# EasyEDA Pro project TalkingTrain.epro, board PCB3_1
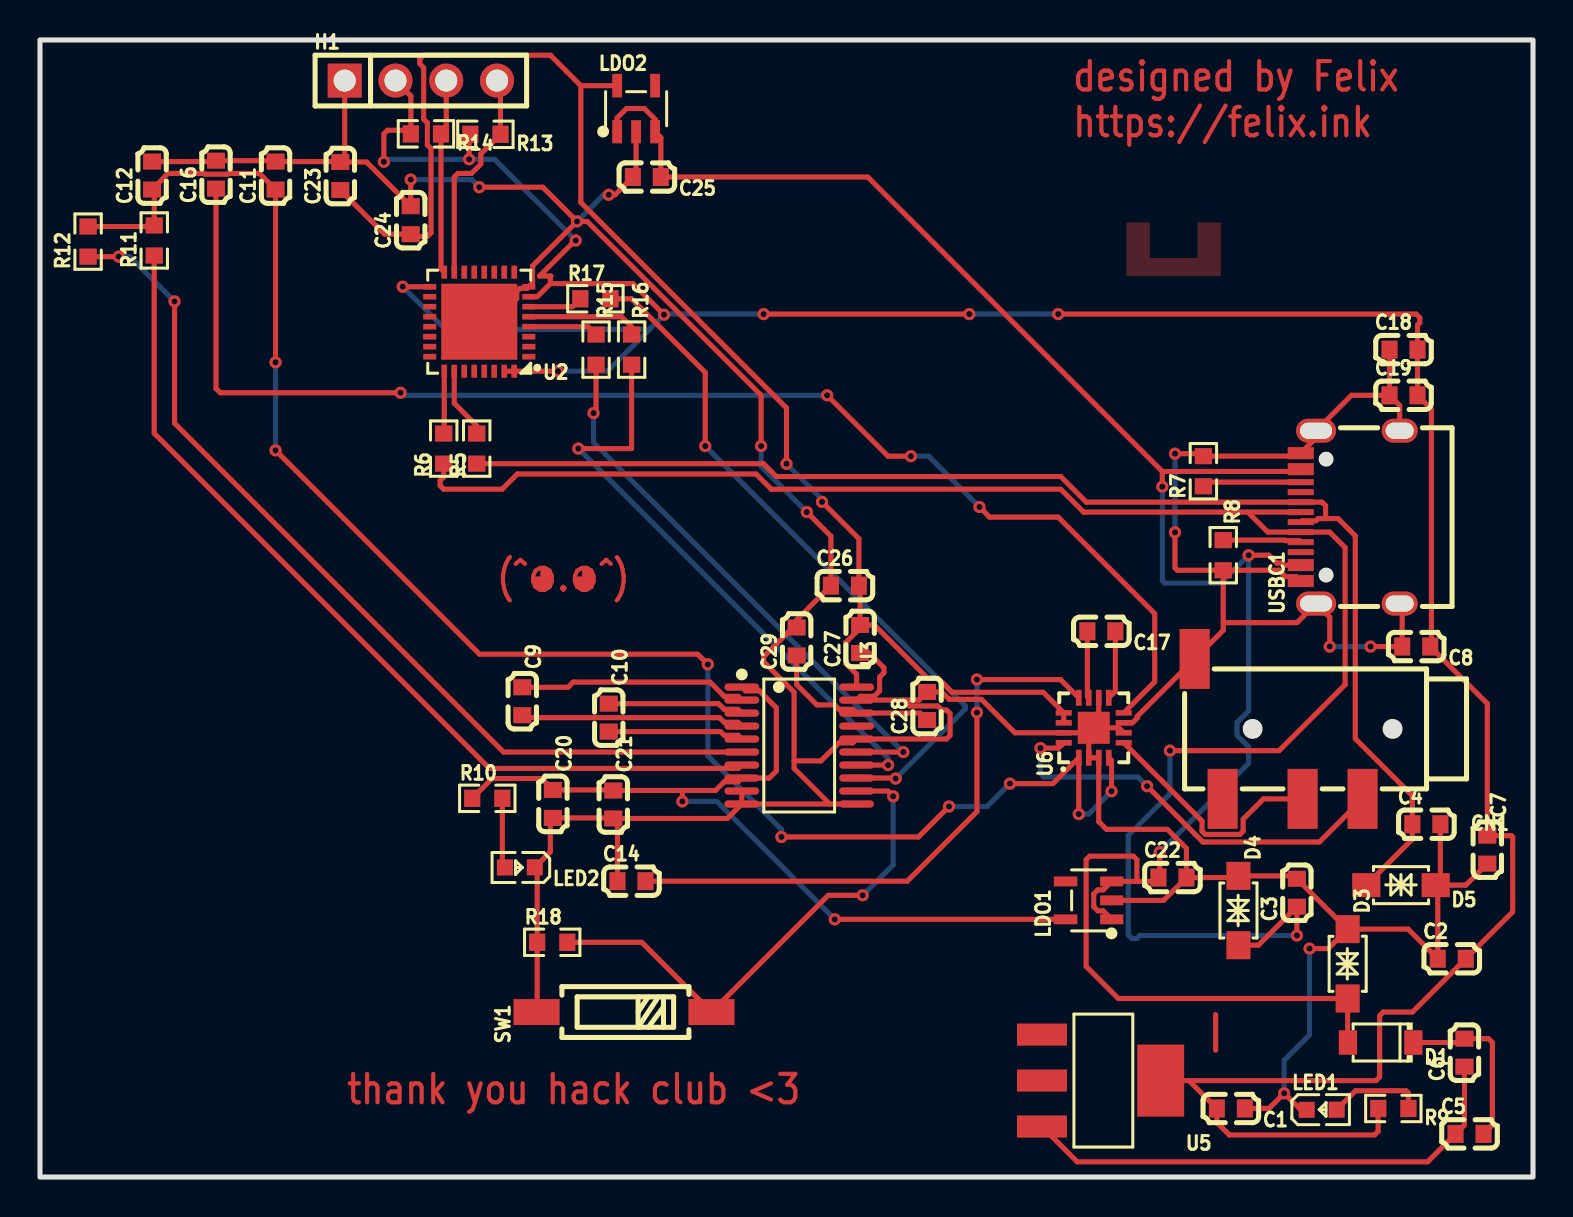
[diagram p1: board, top side]
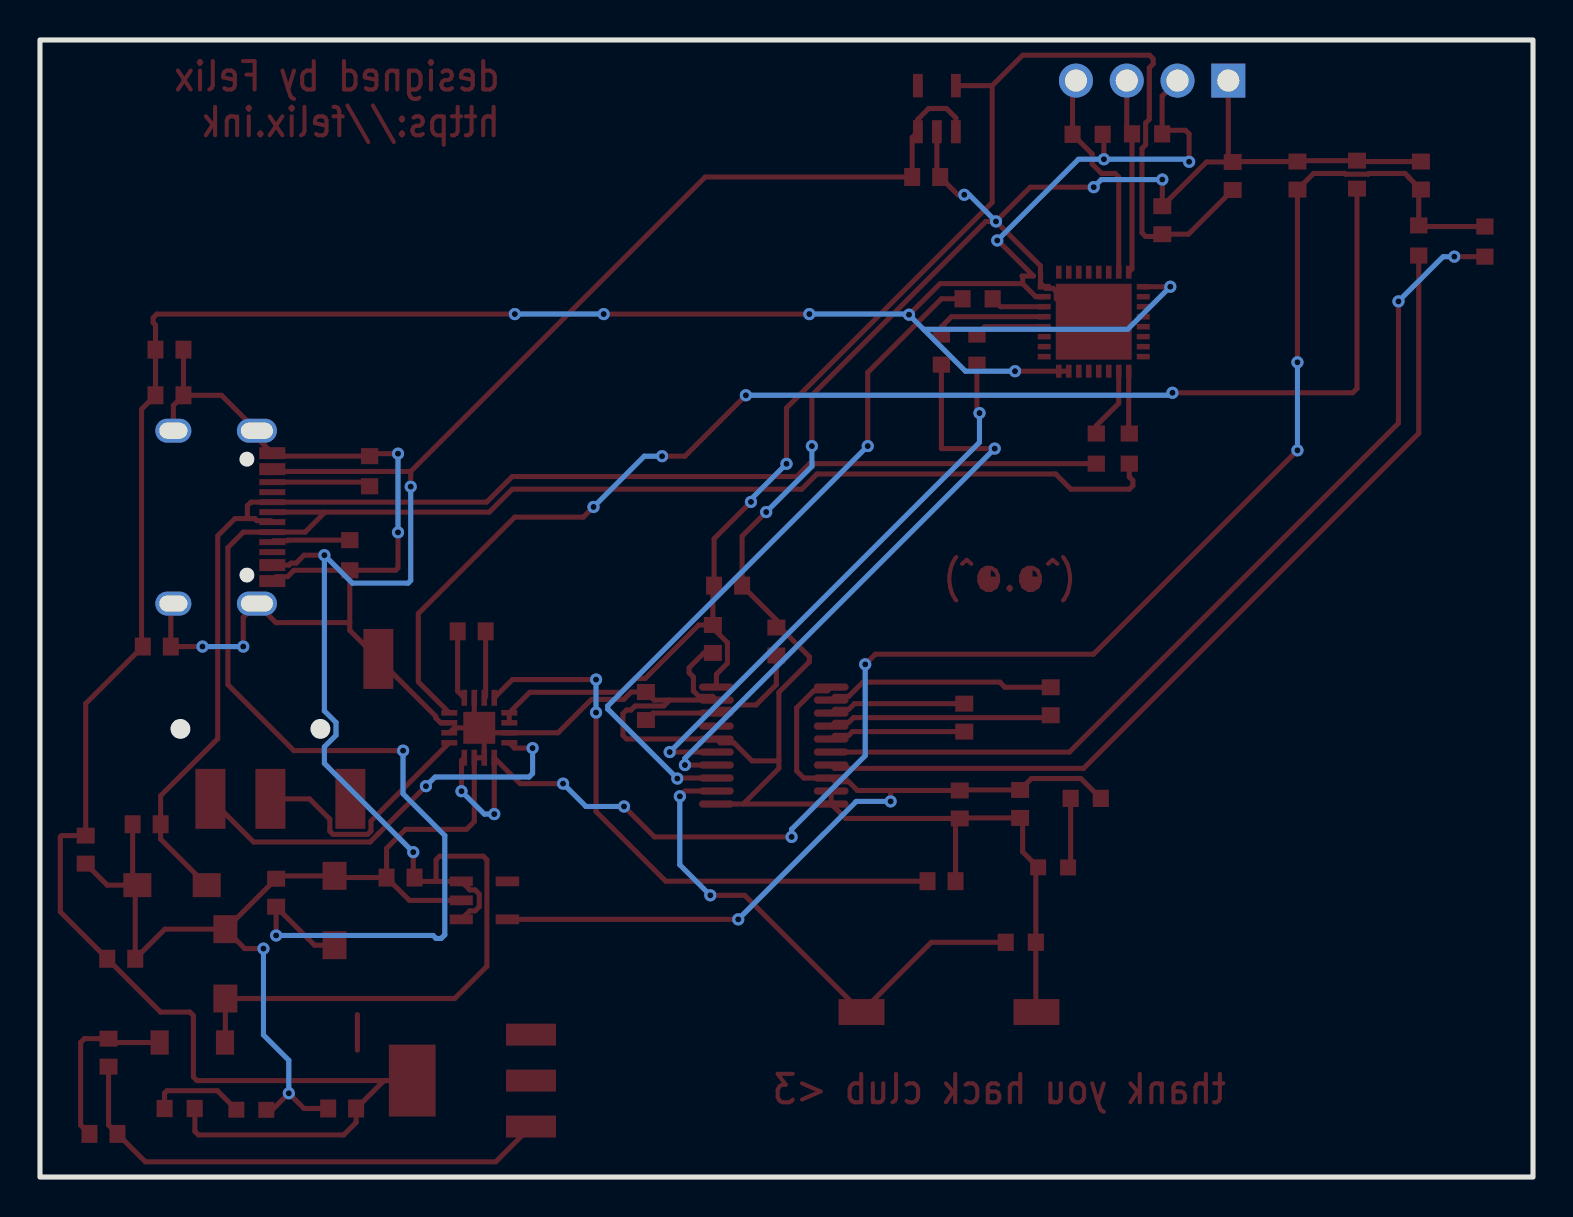
[diagram p2: board, bottom side, seen from below]

Outline 74.68 x 56.9 mm; copper layers: Top Layer, Bottom Layer. Coordinates in mm from the lower left corner of the outline.
Outline path: rectangle 0,56.9 74.68,0
Stack: Top Layer 0.035mm / Dielectric1 1.51mm FR4 er 4.5 / Bottom Layer 0.035mm

## Design rules (mm)
template: JLCPCB Capability(Two Layers Board)
spacing copperThickness1oz (default): track to track 0.102, other pairs 0.152 to 0.3
spacing copperThickness2oz: track to track 0.203, other pairs 0.152 to 0.3
track width copperThickness1oz (default): min 0.127, default 0.254, max 2.54
track width copperThickness2oz: min 0.203, default 0.254, max 2.54
differential pair differentialPair (default): width min 0.127, default 0.254, max 2.54; gap min 0.152, default 0.152
via viaSize (default): diameter min 0.5, default 0.61, max 10; hole min 0.3, default 0.305, max 6.3

## Placement (name value [footprint] x y rotation side)
C1  100nF  [C0603]  59.56 3.43 180 top
C2  1uF  [C0603]  70.61 10.92 0 top
C3  22pF  [C0603]  62.86 14.22 90 top
C4  22pF  [C0603]  69.34 17.65 0 top
C5  10uF  [C0603]  71.5 2.16 0 top
C6  100nF  [C0603]  71.25 6.22 90 top
C7  10uF  [C0603]  72.39 16.38 270 top
C8  100nF  [C0603]  68.83 26.54 180 top
C9  2.2uF  [C0603]  24.12 23.81 270 top
C10  2.2uF  [C0603]  28.45 22.99 270 top
C11  2.2uF  [C0603]  11.78 50.11 90 top
C12  2.2uF  [C0603]  5.61 50.11 90 top
C14  2.2uF  [C0603]  29.58 14.8 0 top
C16  2.2uF  [C0603]  8.8 50.16 90 top
C17  1uF  [C0603]  53.09 27.3 180 top
C18  10nF  [C0603]  68.2 41.4 0 top
C19  1uF  [C0603]  68.2 39.12 0 top
C20  100nF  [C0603]  25.65 18.67 270 top
C21  10uF  [C0603]  28.67 18.64 270 top
C22  100nF  [C0603]  56.64 14.99 0 top
C23  100nF  [C0603]  15.02 50.09 90 top
C24  10uF  [C0603]  18.54 47.88 90 top
C25  100nF  [C0603]  30.35 50.04 180 top
C26  100nF  [C0603]  40.26 29.59 0 top
C27  10uF  [C0603]  41.02 26.92 90 top
C28  10uF  [C0603]  44.37 23.57 90 top
C29  100nF  [C0603]  37.85 26.8 90 top
CN1  PJ-320D  [AUDIO-SMD_PJ-320D-1]  61.95 22.42 180 top
D1  1N5819HW-7-F  [SOD-123_L2.7-W1.6-LS3.7-RD]  67.06 6.73 180 top
D3  SMF6.0CA  [SOD-123FL_L2.7-W1.8-LS3.8-BI]  65.4 10.67 270 top
D4  SMF6.0CA  [SOD-123FL_L2.7-W1.8-LS3.8-BI]  59.94 13.33 270 top
D5  SMF6.0CA  [SOD-123FL_L2.7-W1.8-LS3.8-BI]  68.07 14.6 180 top
H1  2.54-1*4P母  [HDR-TH_4P-P2.54-V-F]  19.05 54.86 0 top
LDO1  ME6211C33M5G-N  [SOT-23-5_L3.0-W1.7-P0.95-LS2.8-BL]  52.45 13.84 90 top
LDO2  ME6211C33M5G-N  [SOT-23-5_L3.0-W1.7-P0.95-LS2.8-BL]  29.82 53.46 0 top
LED1  XL-1608SURC-06  [LED0603-RD_RED]  64.1 3.37 0 top
LED2  XL-1608SURC-06  [LED0603-RD_RED]  24 15.49 180 top
R5  22Ω  [R0603]  21.84 36.45 270 top
R6  22Ω  [R0603]  20.19 36.45 270 top
R7  5kΩ  [R0603]  58.19 35.32 90 top
R8  5kΩ  [R0603]  59.18 31.11 270 top
R9  100Ω  [R0603]  67.69 3.43 180 top
R10  1kΩ  [R0603]  22.37 18.95 0 top
R11  470Ω  [R0603]  5.72 46.86 90 top
R12  470Ω  [R0603]  2.41 46.81 90 top
R13  4.7kΩ  [R0603]  22.28 52.17 180 top
R14  4.7kΩ  [R0603]  19.3 52.2 180 top
R15  220Ω  [R0603]  27.81 41.4 270 top
R16  220Ω  [R0603]  29.59 41.4 270 top
R17  220Ω  [R0603]  27.78 43.94 0 top
R18  220Ω  [R0603]  25.62 11.75 0 top
SW1  DSIC01LSGET  [SW-SMD_DSIC01LSGET]  29.21 8.25 90 top
U2  ESP32-C3FH4  [QFN-32_L5.0-W5.0-P0.50-TL-EP3.7]  21.97 42.8 180 top
U3  PCM5102APWR  [TSSOP-20_L6.5-W4.4-P0.65-LS6.4-BL]  37.97 21.59 270 top
U5  AMS1117-3.3  [SOT-223-3_L6.5-W3.4-P2.30-LS7.0-BR]  53.09 4.83 180 top
U6  TPA6132A2RTER  [WQFN-16_L3.0-W3.0-P0.50-TL-EP1.6]  52.7 22.48 90 top
USBC1  TYPE-C-31-M-12  [USB-C_SMD-TYPE-C-31-M-12_1]  65.53 33.02 90 top

## Footprints (pads in the part's own frame, mm; a bottom-side part is the same pattern mirrored in y, then rotated)
AUDIO-SMD_PJ-320D-1
  rect 1.5x3 smd: 1(4.2,-3.5) 2(-4.2,3.5) 3(-1.2,3.5) 4(2.8,3.5)
C0603
  rect 0.8x0.9 smd: 1(-0.7,0) 2(0.7,0)
HDR-TH_4P-P2.54-V-F
  rect 1.7x1.7 hole 1.1: 1(-3.81,0)
  round 1.7 hole 1.1: 2(-1.27,0) 3(1.27,0) 4(3.81,0)
LED0603-RD_RED
  rect 0.8x0.8 smd: 1(-0.749,-0.004) 2(0.749,0.004)
QFN-32_L5.0-W5.0-P0.50-TL-EP3.7
  rect 0.65x0.28 smd: 1(-2.478,1.75) 2(-2.478,1.25) 3(-2.478,0.75) 4(-2.478,0.25) 5(-2.478,-0.25) 6(-2.478,-0.75) 7(-2.478,-1.25) 8(-2.478,-1.75) 17(2.478,-1.75) 18(2.478,-1.25) 19(2.478,-0.75) 20(2.478,-0.25) 21(2.478,0.25) 22(2.478,0.75) 23(2.478,1.25) 24(2.478,1.75)
  rect 0.28x0.65 smd: 9(-1.75,-2.478) 10(-1.25,-2.478) 11(-0.75,-2.478) 12(-0.25,-2.478) 13(0.25,-2.478) 14(0.75,-2.478) 15(1.25,-2.478) 16(1.75,-2.478) 25(1.75,2.478) 26(1.25,2.478) 27(0.75,2.478) 28(0.25,2.478) 29(-0.25,2.478) 30(-0.75,2.478) 31(-1.25,2.478) 32(-1.75,2.478)
  rect 3.8x3.8 smd: 33(0,0)
R0603
  rect 0.806x0.864 smd: 1(-0.753,0) 2(0.753,0)
SOD-123_L2.7-W1.6-LS3.7-RD
  rect 0.91x1.22 smd: 1(-1.635,0) 2(1.635,0)
SOD-123FL_L2.7-W1.8-LS3.8-BI
  rect 1.4x1.2 smd: 1(-1.735,0) 2(1.735,0)
SOT-23-5_L3.0-W1.7-P0.95-LS2.8-BL
  rect 0.49x1.157 smd: 1(-0.95,-1.153) 2(0,-1.153) 3(0.95,-1.153)
  rect 0.49x1.175 smd: 4(0.95,1.153) 5(-0.95,1.153)
SOT-223-3_L6.5-W3.4-P2.30-LS7.0-BR
  rect 2.5x1.1 smd: 1(2.97,-2.3) 2(2.97,0) 3(2.97,2.3)
  rect 2.34x3.6 smd: 4(-2.97,0)
SW-SMD_DSIC01LSGET
  rect 1.3x2.3 smd: 1(0,4.375) 2(0,-4.375)
TSSOP-20_L6.5-W4.4-P0.65-LS6.4-BL
  oval 0.364x1.742 smd: 1(-2.925,-2.871) 2(-2.275,-2.871) 3(-1.625,-2.871) 4(-0.975,-2.871) 5(-0.325,-2.871) 6(0.325,-2.871) 7(0.975,-2.871) 8(1.625,-2.871) 9(2.275,-2.871) 10(2.925,-2.871) 11(2.925,2.871) 12(2.275,2.871) 13(1.625,2.871) 14(0.975,2.871) 15(0.325,2.871) 16(-0.325,2.871) 17(-0.975,2.871) 18(-1.625,2.871) 19(-2.275,2.871) 20(-2.925,2.871)
USB-C_SMD-TYPE-C-31-M-12_1
  oval 1.2x2 hole 0.8x1.6: 1(4.325,1.706) 4(-4.325,1.706)
  oval 1.2x1.8 hole 0.8x1.4: 2(4.325,-2.474) 3(-4.325,-2.474)
  custom 0.6x1.3 smd: A1B12(-3.2,2.474) A4B9(-2.4,2.474) B1A12(3.2,2.474) B4A9(2.401,2.474)
  rect 0.3x1.3 smd: A5(-1.25,2.474) A6(-0.25,2.474) A7(0.25,2.474) A8(1.25,2.474) B5(1.75,2.474) B6(0.75,2.474) B7(-0.75,2.474) B8(-1.75,2.474)
WQFN-16_L3.0-W3.0-P0.50-TL-EP1.6
  rect 0.8x0.28 smd: 1(-1.5,0.749) 2(-1.5,0.249) 3(-1.5,-0.249) 4(-1.5,-0.75) 9(1.5,-0.75) 10(1.5,-0.249) 11(1.5,0.249) 12(1.5,0.749)
  rect 0.28x0.8 smd: 5(-0.749,-1.5) 6(-0.249,-1.5) 7(0.249,-1.5) 8(0.75,-1.5) 13(0.75,1.5) 14(0.249,1.5) 15(-0.249,1.5) 16(-0.749,1.5)
  rect 1.6x1.6 smd: 17(0,0)

## Nets
GND: C1.1 C2.1 C3.2 C4.2 C7.2 C8.2 C11.2 C12.2 C14.1 C16.2 C18.1 C19.1 C20.2 C21.2 C22.2 C23.2 C24.2 C25.2 C26.1 C27.1 C28.2 C29.2 CN1.1 D3.1 D4.1 D5.1 H1.1 LDO1.2 LDO2.2 LED1.1 LED2.1 R7.2 R8.2 R18.1 SW1.1 U2.8 U2.33 U3.9 U3.10 U3.11 U3.16 U3.19 U6.2 U6.3 U6.6 U6.7 U6.10 U6.15 U6.17 USBC1.1 USBC1.2 USBC1.3 USBC1.4 USBC1.A1B12 USBC1.B1A12
$1N1802: H1.3 R14.1 U2.16
$1N1808: H1.4 R13.1 U2.15
$1N2174: R5.1 U2.26
$1N2178: R6.1 U2.25
$1N2608: R7.1 USBC1.B5
$1N2732: R8.1 USBC1.A5
$1N3437: C22.1 C25.1 D1.2 D3.2 LDO1.1 LDO1.3 LDO2.1 LDO2.3 USBC1.A4B9 USBC1.B4A9
$1N3484: C3.1 D4.2 R6.2 USBC1.A7 USBC1.B7
$1N3488: C4.1 D5.2 R5.2 USBC1.A6 USBC1.B6
$1N4706: C5.1 C6.1 U5.3
$1N4804: C5.2 C6.2 D1.1
$1N5192: LED1.2 R9.1
$1N6728: C9.1 U3.2
$1N6732: C9.2 U3.4
$1N6738: C10.1 U3.3
$1N6815: LED2.2 R10.2
$1N6838: R12.1 U3.6
$1N6938: R11.1 U3.7
$1N7036: C11.1 C12.1 R11.2 R12.2 U6.1 U6.4
$1N7742: CN1.3 U6.5
$1N7752: CN1.2 U6.16
$1N8430: C14.2 U6.12
$1N8534: C16.1 U6.8
$1N8599: C17.1 U6.9
$1N8604: C17.2 U6.11
$1N10130: C1.2 C2.2 C7.1 C8.1 C18.2 C19.2 H1.2 R9.2 R13.2 R14.2 U2.7 U2.17 U2.31 U2.32 U5.4
$1N10789: C20.1 C21.1 LDO1.5 R10.1 U3.1 U3.8
$1N11578: C23.1 C24.1 C26.2 C27.2 LDO2.5 U3.20 U6.13 U6.14
$1N11814: C28.1 C29.1 U3.18
$1N12011: R15.2 U3.15
$1N12041: R16.2 U3.14
$1N12085: R17.2 U3.13
$1N12091: R18.2 SW1.2 U3.12
$1N12135: R17.1 U2.6
$1N12139: R16.1 U2.5
$1N12143: R15.1 U2.4
$1N12295: C10.2 U3.5

Pads without a net: CN1 4; LDO1 4; LDO2 4; U2 1 2 3 9 10 11 12 13 14 18 19 20 21 22 23 24 27 28 29 30; U3 17; U5 1 2; USBC1 A8 B8

## Via types
v1: diameter 0.61, hole 0.305, Top Layer to Bottom Layer, 56 vias

## Routing (per net, layer and track width the routed paths; a pad name or vN(x,y) marks a point on that pad's centre or on a via; arc(x,y) is an arc through that point)
GND: length 247.4
  Top Layer w0.254: 52.46,22.23 U6.2 U6.3 52.95,17.78 53.34,17.4 56.39,17.4 57.34,16.44 C22.2 ; 52.46,22.23 U6.17 ; 52.46,22.23 U6.15 48.76,22.23 47.09,23.9 45.48,23.9 45.11,24.27 C28.2 43.96,23.86 43.18,23.86 ; LDO2.2 29.82,50.2 C25.2 28.76,49.15 v1(28.45,49.15) ; U3.10 34.38,17.94 C21.2 ; U3.10 39.5,18.66 ; U3.10 U3.9 ; D3.1 68.43,12.4 C2.1 69.91,14.5 D5.1 ; D3.1 64.43,11.43 v1(63.5,11.43) ; D3.1 65.39,12.4 C3.2 62.72,15.07 59.94,15.07 59.86,14.99 C22.2 ; H1.1 15.24,51.01 15.02,50.79 ; U6.7 54.64,22.73 54.88,22.97 54.88,23.06 CN1.1 59.18,27.35 59.18,27.74 ; C14.1 28.88,17.73 C21.2 ; C27.1 41.47,26.22 42.21,25.48 42.21,25.23 41.99,25.01 41.99,24.32 41.72,24.05 41.03,24.05 U3.19 43.18,23.86 ; C21.2 28.65,17.97 C20.2 25.53,17.84 25.53,16.27 LED2.1 24.87,15.38 R18.1 24.87,8.29 SW1.1 ; U6.6 53.96,22.48 U6.17 ; 15.02,50.79 15,50.81 C11.2 11.74,50.86 C16.2 8.76,50.81 C12.2 ; 15.02,50.79 16.33,50.79 C24.2 v1(18.54,49.91) ; C7.2 71.31,14.6 D5.1 ; USBC1.2 68.01,38.61 C19.1 ; v1(56.77,32.26) 56.77,30.48 56.89,30.36 R8.2 ; U3.11 39.5,18.66 ; 39.5,18.66 37.72,20.45 37.72,20.82 ; C1.1 61.47,3.43 v1(62.23,4.19) 63.06,3.36 LED1.1 ; D5.1 70.04,14.84 C4.2 ; 37.72,20.82 37.72,24.26 36.2,25.78 36.2,26.03 37.66,27.5 C29.2 37.85,27.88 C26.1 39.56,32.07 v1(38.35,33.27) ; 37.72,20.82 39.06,20.82 39.96,21.73 40.65,21.73 U3.16 40.85,21.92 45.34,21.92 45.52,22.1 45.52,23.19 45.34,23.37 45.11,23.37 44.91,23.57 43.47,23.57 43.18,23.86 ; U6.17 52.95,22.73 U6.10 ; v1(21.97,49.53) 25.15,49.53 v1(26.86,47.82) ; C22.2 56.2,13.84 LDO1.2 ; v1(64.51,26.54) 64.51,28.01 USBC1.4 62.87,27.74 59.18,27.74 ; 59.18,27.74 R8.2 ; C19.1 65.6,39.12 USBC1.1 63.83,36.99 USBC1.B1A12 62.91,36.07 R7.2 58.07,36.19 v1(56.77,36.19) ; C19.1 C18.1 ; U2.33 22.7,42.8 23.84,43.94 23.84,44.3 24.01,44.47 24.37,44.47 U2.8 24.64,44.74 24.64,44.93 24.63,44.94 24.63,45.23 24.64,45.24 24.64,45.59 v1(26.86,47.82) ; R8.2 61.97,30.36 62.29,30.04 62.84,30.04 USBC1.A1B12 ; v1(26.86,47.82) 27.37,47.82 36.07,39.12 v1(36.07,36.58) ; v1(66.55,26.54) C8.2 68.13,28.57 USBC1.3
  Bottom Layer w0.254: v1(56.77,36.19) v1(56.77,32.26) ; v1(21.97,49.53) 21.59,49.91 v1(18.54,49.91) ; v1(63.5,11.43) 63.5,7.11 62.23,5.84 v1(62.23,4.19) ; v1(64.51,26.54) v1(66.55,26.54) ; v1(38.35,33.27) 36.07,35.56 v1(36.07,36.58) ; v1(26.86,47.82) 28.19,49.15 v1(28.45,49.15)
(no net): length 1.8
  Top Layer w0.254: 58.8,6.35 58.8,8.13
$1N1802: length 9.8
  Top Layer w0.254: U2.16 20.06,45.44 R14.1 20.32,52.46 H1.3
$1N1808: length 11
  Top Layer w0.254: U2.15 20.72,50.04 20.9,50.22 21.58,50.22 22.05,50.68 22.05,51.19 R13.1 23.03,54.69 H1.4
$1N2174: length 3.6
  Top Layer w0.254: U2.26 20.72,38.71 21.84,37.59 R5.1
$1N2178: length 3.1
  Top Layer w0.254: U2.25 20.22,37.23 R6.1
$1N2608: length 5
  Top Layer w0.254: USBC1.B5 58.4,34.77 R7.1
$1N2732: length 3.9
  Top Layer w0.254: R8.1 62.27,31.87 62.29,31.84 62.99,31.84 USBC1.A5
$1N3437: length 106.3
  Top Layer w0.254: USBC1.A4B9 62.22,30.62 62.12,30.72 61.87,30.72 61.47,31.11 v1(60.45,31.11) ; 54.8,14.79 54.86,14.86 54.86,15.87 54.68,16.05 52.5,16.05 52.32,15.87 52.32,10.54 53.93,8.93 D3.2 65.4,6.75 D1.2 ; 54.8,14.79 LDO1.3 53.18,14.37 52.91,14.37 52.7,14.16 52.7,13.52 52.91,13.32 53.18,13.32 LDO1.1 ; 54.8,14.79 55.75,14.79 56.01,15.05 v1(56.01,16.26) ; 56.13,35.31 41.4,50.04 C25.1 31.05,52.02 LDO2.3 30.77,52.93 30.23,53.47 29.34,53.47 28.87,53 LDO2.1 ; 56.13,35.31 v1(56.13,34.54) ; 56.13,35.31 62.94,35.31 USBC1.B4A9
  Bottom Layer w0.254: v1(56.01,16.26) 60.45,20.7 60.45,21.52 59.87,22.1 59.87,22.75 60.45,23.33 v1(60.45,31.11) 59.05,29.72 56.26,29.72 56.13,29.84 v1(56.13,34.54)
$1N3484: length 91.8
  Top Layer w0.254: R6.2 20.19,35.03 20.01,34.85 20.01,34.6 20.19,34.42 23.11,34.42 23.88,35.18 35.81,35.18 36.58,34.42 51.05,34.42 52.2,33.27 60.41,33.27 ; v1(56.52,21.34) 61.98,21.34 65.28,24.64 65.28,31.5 64.5,32.27 USBC1.B7 61.41,32.27 60.41,33.27 ; v1(62.86,12.09) C3.1 60.94,11.6 D4.2 ; USBC1.A7 60.41,33.27
  Bottom Layer w0.254: v1(56.52,21.34) 56.52,19.18 54.43,17.09 54.43,12.12 54.61,11.94 54.86,11.94 55.01,12.09 v1(62.86,12.09)
$1N3488: length 66.8
  Top Layer w0.254: USBC1.A6 63.13,32.84 63.82,32.84 63.93,32.95 64.3,32.95 ; 64.3,32.95 64.93,32.95 65.79,32.09 65.79,21.93 68.64,19.08 C4.1 68.64,16.91 D5.2 ; 64.3,32.95 64.3,33.59 64.12,33.77 USBC1.B6 52.34,33.77 51.05,35.05 36.83,35.05 36.19,35.7 R5.2
$1N4706: length 25.5
  Top Layer w0.254: U5.3 51.88,0.76 69.4,0.76 C5.1 71.25,2.6 C6.1
$1N4804: length 8.9
  Top Layer w0.254: D1.1 71.05,6.73 C6.2 72.45,6.92 72.64,6.73 72.64,2.6 C5.2
$1N5192: length 4.8
  Top Layer w0.254: R9.1 68.44,4.2 68.33,4.32 65.8,4.32 LED1.2
$1N6728: length 11.5
  Top Layer w0.254: U3.2 34.91,24.05 34.22,24.05 33.51,24.76 26.67,24.76 26.41,24.51 C9.1
$1N6732: length 11.2
  Top Layer w0.254: U3.4 34.91,22.75 34.22,22.75 33.99,22.99 24.24,22.99 C9.2
$1N6738: length 6.8
  Top Layer w0.254: U3.3 34.91,23.4 34.22,23.4 33.94,23.69 C10.1
$1N6815: length 3.5
  Top Layer w0.254: R10.2 23.13,15.62 LED2.2
$1N6838: length 46.5
  Top Layer w0.254: v1(6.73,43.81) 6.73,37.72 23.18,21.26 U3.6 ; R12.1 v1(3.94,46.05)
  Bottom Layer w0.254: v1(6.73,43.81) 4.49,46.05 v1(3.94,46.05)
$1N6938: length 45.3
  Top Layer w0.254: U3.7 34.93,20.45 22.48,20.45 5.72,37.21 R11.1
$1N7036: length 84.5
  Top Layer w0.254: v1(11.78,40.77) C11.1 10.98,50.22 9.41,50.22 9.37,50.18 8.24,50.18 8.2,50.22 6.4,50.22 6.22,50.04 6.22,50.03 C12.1 5.72,49.3 R11.2 5.66,47.56 R12.2 ; v1(45.47,18.54) 43.94,17.02 v1(37.08,17.02) ; v1(11.78,36.36) 21.98,26.16 32.89,26.16 v1(33.4,25.65) ; v1(53.59,19.3) 53.59,20.84 U6.4 ; v1(51.96,18.16) U6.1 50.66,19.68 v1(48.51,19.68)
  Bottom Layer w0.254: v1(51.96,18.16) 52.45,18.16 v1(53.59,19.3) ; v1(37.08,17.02) 37.08,17.4 33.4,21.08 v1(33.4,25.65) ; v1(45.47,18.54) 47.37,18.54 v1(48.51,19.68) ; v1(11.78,40.77) v1(11.78,36.36)
$1N7742: length 12.2
  Top Layer w0.254: U6.5 58.12,17.81 58.12,17.31 58.29,17.14 60.02,17.14 60.18,17.31 60.18,17.91 61.2,18.92 CN1.3
$1N7752: length 21
  Top Layer w0.254: U6.16 50.94,21.46 v1(50.04,21.46) ; v1(55.37,19.56) 57.77,17.16 57.77,17.16 58.14,16.79 58.14,16.79 58.17,16.76 63.99,16.76 CN1.2
  Bottom Layer w0.254: v1(50.04,21.46) 50.04,20.19 50.22,20.01 54.92,20.01 v1(55.37,19.56)
$1N8430: length 30.1
  Top Layer w0.254: U6.12 51.04,24.89 v1(46.86,24.89) ; 30.28,14.8 43.38,14.8 46.86,18.29 v1(46.86,23.24)
  Bottom Layer w0.254: v1(46.86,24.89) v1(46.86,23.24)
$1N8534: length 67.2
  Top Layer w0.254: U6.8 55.75,24.78 55.75,28.19 50.93,33.02 47.5,33.02 v1(46.99,33.53) ; v1(43.56,36.07) 42.42,36.07 v1(39.37,39.12) ; C16.1 8.8,39.46 9.02,39.24 v1(18.03,39.24)
  Bottom Layer w0.254: v1(43.56,36.07) 44.45,36.07 v1(46.99,33.53) ; v1(39.37,39.12) 18.16,39.12 v1(18.03,39.24)
$1N8599: length 3.5
  Top Layer w0.254: C17.1 53.79,24.31 U6.9
$1N8604: length 3.4
  Top Layer w0.254: U6.11 52.39,24.05 C17.2
$1N10130: length 158.9
  Top Layer w0.254: v1(31.21,43.15) 29.65,44.7 25.53,44.7 ; 25.53,44.7 25.53,45.06 25.55,45.08 24.98,45.08 26.76,46.86 v1(26.8,46.86) ; 25.53,44.7 24.87,44.05 U2.7 ; U2.17 v1(18.14,44.55) ; R13.2 21.46,52.11 v1(21.46,50.93) ; v1(25.91,40.32) U2.32 U2.31 ; H1.2 18.55,54.09 R14.2 18.37,52.38 17.38,52.38 17.2,52.2 v1(17.2,50.8) ; 57.47,4.83 C1.2 58.86,2.73 59.49,2.11 66.75,2.11 66.93,2.29 66.93,3.42 R9.2 ; 57.47,4.83 66.82,4.83 67,5.01 67,8.08 67.18,8.25 68.64,8.25 C2.2 73.66,13.27 73.66,17.02 73.59,17.08 C7.1 72.39,23.69 C8.1 69.6,26.6 69.6,38.42 C19.2 C18.2 68.9,42.63 69.01,42.75 69.01,43 68.83,43.18 v1(50.93,43.18) ; 57.47,4.83 U5.4 ; v1(36.2,43.18) v1(46.48,43.18)
  Bottom Layer w0.254: v1(36.2,43.18) 31.24,43.18 v1(31.21,43.15) 30.48,42.42 ; 30.48,42.42 20.27,42.42 v1(18.14,44.55) ; 30.48,42.42 28.38,40.32 v1(25.91,40.32) ; v1(26.8,46.86) 22.73,50.93 v1(21.46,50.93) 17.33,50.93 v1(17.2,50.8) ; v1(46.48,43.18) v1(50.93,43.18)
$1N10789: length 43.8
  Top Layer w0.254: LDO1.5 v1(39.75,12.89) ; 32.12,19.34 C21.1 28.65,19.37 C20.1 25.08,19.94 22.61,19.94 R10.1 ; 32.12,19.34 32.13,19.33 v1(32.13,18.8) ; 32.12,19.34 33.79,19.34 34.22,19.78 34.91,19.78 U3.8 36.48,19.96 36.83,20.32 36.83,23.48 35.98,24.33 35.29,24.33 U3.1
  Bottom Layer w0.254: v1(32.13,18.8) 33.85,18.8 v1(39.75,12.89)
$1N11578: length 74
  Top Layer w0.254: 41.02,27.62 40.84,27.45 40.84,27.29 40.29,26.74 40.29,25.71 40.84,25.16 U3.20 ; 41.02,27.62 41.02,29.53 C26.2 40.96,31.94 v1(39.12,33.78) ; 41.02,27.62 41.73,27.62 44.41,24.95 44.93,24.95 45.62,24.26 50.18,24.26 U6.13 U6.14 ; 27.05,54.61 25.53,56.13 19.18,56.13 19,55.95 19,55.7 19.19,55.51 19.19,52.93 19.37,52.74 19.37,51.65 19.56,51.47 19.56,47.24 19.38,47.06 18.66,47.06 C24.1 17.23,47.18 C23.1 ; 27.05,54.61 LDO2.5 ; 27.05,54.61 27.05,48.77 37.34,38.48 v1(37.34,35.69)
  Bottom Layer w0.254: v1(39.12,33.78) 39.12,33.91 v1(37.34,35.69)
$1N11814: length 8.7
  Top Layer w0.254: C29.1 37.85,24.64 38.86,23.62 39.75,23.62 39.96,23.4 40.65,23.4 U3.18 44.02,23.21 C28.1
$1N12011: length 28.2
  Top Layer w0.254: v1(27.69,38.23) 27.81,38.35 R15.2 ; U3.15 v1(43.18,21.26)
  Bottom Layer w0.254: v1(43.18,21.26) 27.69,36.76 v1(27.69,38.23)
$1N12041: length 30.7
  Top Layer w0.254: R16.2 29.59,36.45 v1(26.92,36.45) ; U3.14 v1(42.42,20.61)
  Bottom Layer w0.254: v1(42.42,20.61) 42.42,20.95 v1(26.92,36.45)
$1N12085: length 35.4
  Top Layer w0.254: v1(33.27,36.58) 33.27,40.26 29.59,43.94 R17.2 ; v1(42.8,19.94) 42.77,19.96 U3.13
  Bottom Layer w0.254: v1(42.8,19.94) 46.28,23.42 46.28,23.57 v1(33.27,36.58)
$1N12091: length 26.2
  Top Layer w0.254: 26.37,11.75 30.09,11.75 SW1.2 39.43,14.1 v1(41.15,14.1) ; U3.12 42.41,19.31 v1(42.67,19.05)
  Bottom Layer w0.254: v1(42.67,19.05) 42.67,15.62 v1(41.15,14.1)
$1N12135: length 2.7
  Top Layer w0.254: U2.6 26.63,43.55 R17.1
$1N12139: length 5.7
  Top Layer w0.254: U2.5 29.08,43.05 29.59,42.54 R16.1
$1N12143: length 3.5
  Top Layer w0.254: U2.4 27.42,42.55 R15.1
$1N12295: length 6.8
  Top Layer w0.254: U3.5 34.91,22.1 34.22,22.1 34.04,22.29 C10.2

## Copper pours and planes (outline as drawn; the poured copper is in the pictures)
(no net) on Top Layer: 57.91,50.16 59.05,50.16 59.05,48.89 57.91,48.89
(no net) on Top Layer: 54.36,50.16 55.5,50.16 55.5,48.89 54.36,48.89
(no net) on Top Layer: 54.35,47.75 59.05,47.75 59.05,45.08 54.35,45.08
(no net) on Top Layer: 54.35,47.75 59.05,47.75 59.05,45.08 54.35,45.08

## Text on the board
Top Layer: thank you hack club <3 | designed by Felix / https://felix.ink | (^◕.◕^)
